# Altium schematic sheet Sheet2.SchDoc
size A4; SheetNumber: 2; SheetTotal: 2
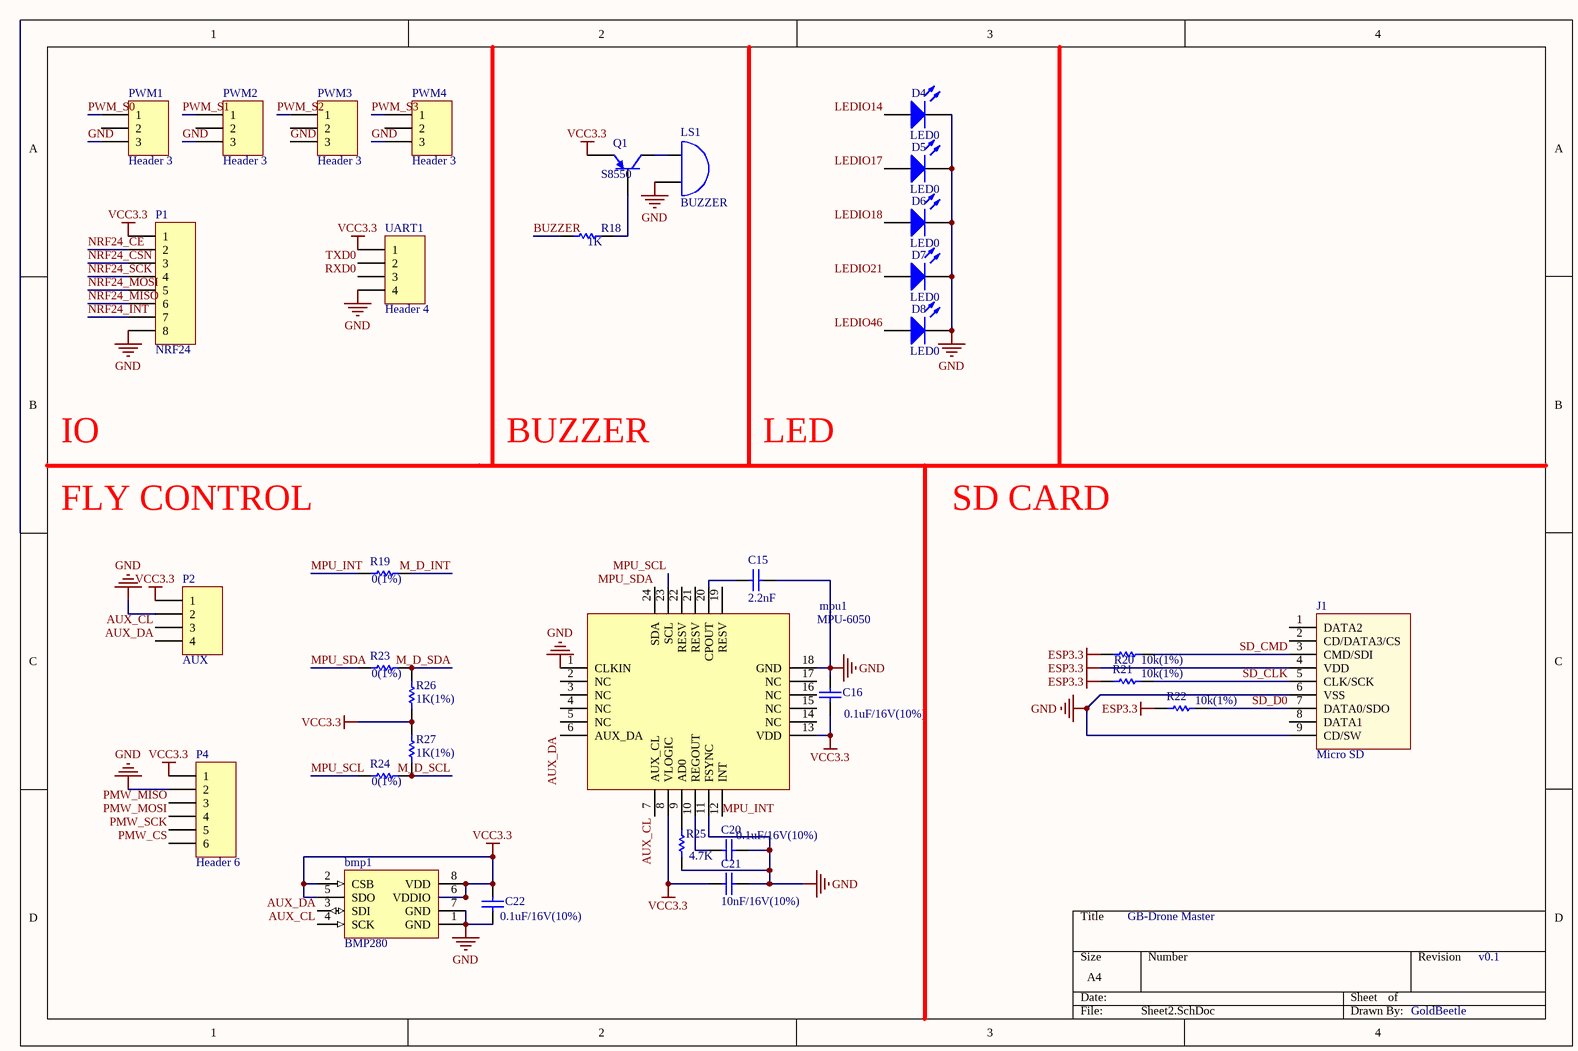
[diagram p0: Sheet2.SchDoc]

## Parts
bmp1  BMP280  [BMP280 LGA8]
C15  2.2nF  [C0805]
C16  0.1uF/16V(10%)  [C0805]
C20  0.1uF/16V(10%)  [C0805]
C21  10nF/16V(10%)  [C0805]
C22  0.1uF/16V(10%)  [C0805]
D4  LED0  [C0805]
D5  LED0  [C0805]
D6  LED0  [C0805]
D7  LED0  [C0805]
D8  LED0  [C0805]
J1  Micro SD  [Micro SD]
LS1  BUZZER  [Beeper]
mpu1  MPU-6050  [QFN24 4X4_N]
P1  NRF24  [NRF24_line]
P2  AUX  [XH2.54-4P]
P4  Header 6  [XH2.54-6P]
PWM1  Header 3  [HDR1X3]
PWM2  Header 3  [HDR1X3]
PWM3  Header 3  [HDR1X3]
PWM4  Header 3  [HDR1X3]
Q1  S8550  [SOT-23B_N]
R18  1K  [C0805]
R19  0(1%)  [C0805]
R20  10k(1%)  [C0805]
R21  10k(1%)  [C0805]
R22  10k(1%)  [C0805]
R23  0(1%)  [C0805]
R24  0(1%)  [C0805]
R25  4.7K  [C0805]
R26  1K(1%)  [C0805]
R27  1K(1%)  [C0805]
UART1  Header 4  [HDR1X4]

## Nets
ESP3.3: J1.4(VDD) R20.2 R21.2 R22.2
GND: bmp1.1(GND) bmp1.7(GND) C15.1 C16.1 C20.1 C21.1 C22.2 D4.2(K) D5.2(K) D6.2(K) D7.2(K) D8.2(K) J1.6(VSS) J1.9(CD/SW) LS1.2(B) mpu1.1(CLKIN) mpu1.11(FSYNC) mpu1.18(GND) P1.8 P2.2 P4.2 PWM1.3 PWM2.3 PWM3.3 PWM4.3 R25.2 UART1.4
VCC3.3: bmp1.2(CSB) bmp1.5(SDO) bmp1.6(VDDIO) bmp1.8(VDD) C16.2 C21.2 C22.1 mpu1.8(VLOGIC) mpu1.13(VDD) P1.1 P2.1 P4.1 Q1.2(E) R26.1 R27.2 UART1.1
AUX_CL: bmp1.4(SCK) mpu1.7(AUX_CL) P2.3
AUX_DA: bmp1.3(SDI) mpu1.6(AUX_DA) P2.4
BUZZER: R18.1
LEDIO14: D4.1(A)
LEDIO17: D5.1(A)
LEDIO18: D6.1(A)
LEDIO21: D7.1(A)
LEDIO46: D8.1(A)
M_D_INT: R19.2
M_D_SCL: R24.2 R27.1
M_D_SDA: R23.2 R26.2
MPU_INT: mpu1.12(INT) R19.1
MPU_SCL: mpu1.23(SCL) R24.1
MPU_SDA: mpu1.24(SDA) R23.1
NRF24_CE: P1.2
NRF24_CSN: P1.3
NRF24_INT: P1.7
NRF24_MISO: P1.6
NRF24_MOSI: P1.5
NRF24_SCK: P1.4
PMW_CS: P4.6
PMW_MISO: P4.3
PMW_MOSI: P4.4
PMW_SCK: P4.5
PWM_S0: PWM1.1
PWM_S1: PWM2.1
PWM_S2: PWM3.1
PWM_S3: PWM4.1
RXD0: UART1.3
SD_CLK: J1.5(CLK/SCK) R21.1
SD_CMD: J1.3(CMD/SDI) R20.1
SD_D0: J1.7(DATA0/SDO) R22.1
TXD0: UART1.2
NetC15_2: C15.2 mpu1.20(CPOUT)
NetC20_2: C20.2 mpu1.10(REGOUT)
NetLS1_1: LS1.1(A) Q1.3(C)
Netmpu1_9: mpu1.9(AD0) R25.1
NetQ1_1: Q1.1(B) R18.2

Not connected (* = marked no-connect by the designer): J1 1(DATA2) 2(CD/DATA3/CS) 8(DATA1); mpu1 2(NC) 3(NC) 4(NC) 5(NC) 14(NC) 15(NC) 16(NC) 17(NC) 19(RESV) 21(RESV) 22(RESV); PWM1 2; PWM2 2; PWM3 2; PWM4 2

## Notes on the sheet
- IO
- BUZZER
- LED
- FLY CONTROL
- SD CARD
- GB-Drone Master
- v0.1
- GoldBeetle

## Library data of the parts
bmp1 = BMP280: 气压传感器
C15 C16 C20-C22 = Cap: Capacitor; Published: 8-Jun-2000; LatestRevisionDate: 17-Jul-2002; LatestRevisionNote: Re-released for DXP Platform.; PackageReference: RAD-0.3; Publisher: Altium Limited; PackageDescription: Radial Cap, Thru-Hole; 2 Leads; 0.3 in Pin Spacing
D4-D8 = LED0: Typical INFRARED GaAs LED; Published: 8-Jun-2000; LatestRevisionDate: 08-Jul-2005; LatestRevisionNote: Mech Layer 1 removed.; PackageReference: LED-0; Publisher: Altium Limited; PackageDescription: LED; 2 Leads
J1 = Micro SD: Micro SD卡; 版权归属: 源创客; BOM名称: Micro SD卡; 学习资源: www.ooocke.com
LS1 = Bell: Electrical Bell; Published: 24-Mar-1999; LatestRevisionDate: 17-Jul-2002; LatestRevisionNote: Re-released for DXP Platform.; PackageReference: PIN2; Publisher: Altium Limited
mpu1 = MPU-6050: 传感器; ComponentLink1Description: 供应商链接; ComponentLink1URL: http://www.szlcsc.com/product/details_24852.html; Package: QFN-24_4x4x05P; Supplier: LC; SuppliersPartNumber: C24112
P1 = Header 8: Header, 8-Pin; LatestRevisionDate: 17-Jul-2002; LatestRevisionNote: Re-released for DXP Platform.; Publisher: Altium Limited
P2 UART1 = Header 4: Header, 4-Pin; LatestRevisionDate: 17-Jul-2002; LatestRevisionNote: Re-released for DXP Platform.; Publisher: Altium Limited
P4 = Header 6: Header, 6-Pin; LatestRevisionDate: 17-Jul-2002; LatestRevisionNote: Re-released for DXP Platform.; Publisher: Altium Limited
PWM1-PWM4 = Header 3: Header, 3-Pin; LatestRevisionDate: 17-Jul-2002; LatestRevisionNote: Re-released for DXP Platform.; Publisher: Altium Limited
Q1 = PNP: PNP Bipolar Transistor; Published: 8-Jun-2000; LatestRevisionDate: 29-May-2009; LatestRevisionNote: IPC-7351 Footprint Added.; PackageVersion: Aug-1999; PackageReference: SOT-23B; Publisher: Altium Limited; PackageDescription: 3-Pin SOT-23 Package 0.95 mm Pitch, 2.4 mm Lead Span
R18-R27 = Res1: Resistor; Published: 8-Jun-2000; LatestRevisionDate: 17-Jul-2002; LatestRevisionNote: Re-released for DXP Platform.; PackageReference: AXIAL-0.3; Publisher: Altium Limited; PackageDescription: Axial Device, Thru-Hole; 2 Leads; 0.3 in Pin Spacing